# Altium project Planck-HUB.PrjPcb
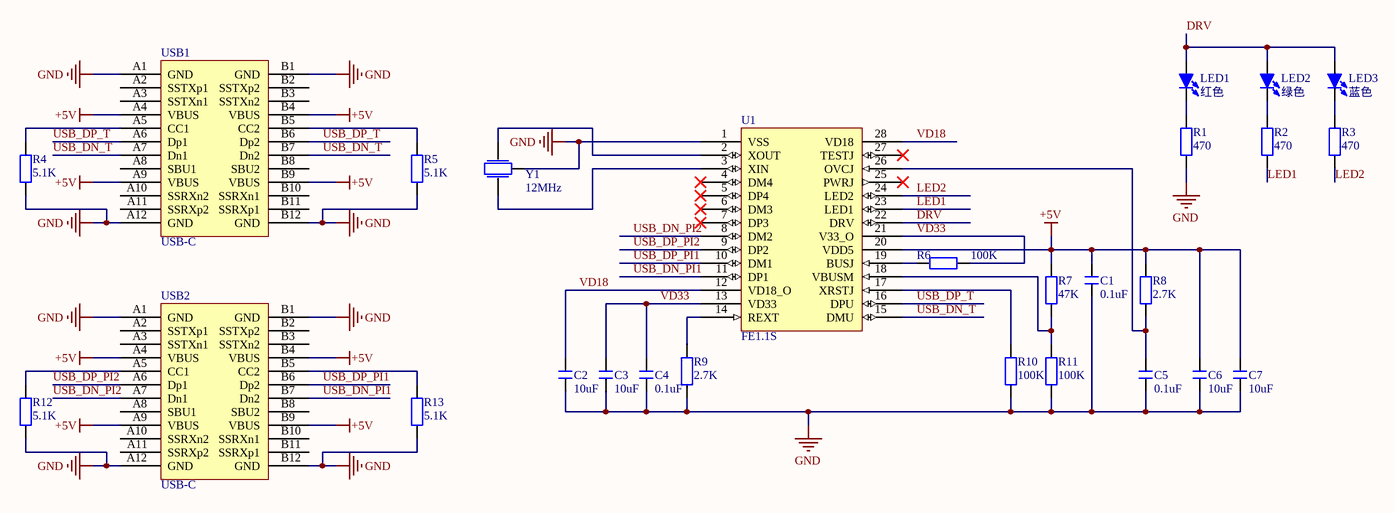
[diagram p0: Planck-HUB.SchDoc]
1 sheet, 27 parts. Net scope: global (net labels, ports and power ports of the same name join across sheets).
Board file: Planck-HUB.PcbDoc

## Sheet Planck-HUB.SchDoc
size A4; SheetNumber: 1; SheetTotal: 1

### Parts
C1  0.1uF  [C 0402_L]
C2  10uF  [C 0402_L]
C3  10uF  [C 0402_L]
C4  0.1uF  [C 0402_L]
C5  0.1uF  [C 0402_L]
C6  10uF  [C 0402_L]
C7  10uF  [C 0402_L]
LED1  红色  [LED_0402_RED]
LED2  绿色  [LED_0402_RED]
LED3  蓝色  [LED_0402_RED]
R1  470  [R 0402_L]
R2  470  [R 0402_L]
R3  470  [R 0402_L]
R4  5.1K  [R 0402_L]
R5  5.1K  [R 0402_L]
R6  100K  [R 0402_L]
R7  47K  [R 0402_L]
R8  2.7K  [R 0402_L]
R9  2.7K  [R 0402_L]
R10  100K  [R 0402_L]
R11  100K  [R 0402_L]
R12  5.1K  [R 0402_L]
R13  5.1K  [R 0402_L]
U1  FE1.1S  [SSOP28_L]
USB1  USB-C  [USB Type-C-16Pin_A]
USB2  USB-C  [USB-C-SMD_TYPE-C-31-G-01]
Y1  12MHz  [晶振-3P]

### Nets
+5V: C1.2 C6.2 C7.2 R7.1 R8.1 U1.20(VDD5) USB1.A4(VBUS) USB1.A9(VBUS) USB1.B4(VBUS) USB1.B9(VBUS) USB2.A4(VBUS) USB2.A9(VBUS) USB2.B4(VBUS) USB2.B9(VBUS)
GND: C1.1 C2.2 C3.1 C4.1 C5.1 C6.1 C7.1 R1.1 R4.1 R5.1 R9.1 R10.2 R11.2 R12.1 R13.1 U1.1(VSS) USB1.A1(GND) USB1.A12(GND) USB1.B1(GND) USB1.B12(GND) USB2.A1(GND) USB2.A12(GND) USB2.B1(GND) USB2.B12(GND) Y1.2
DRV: LED1.1(A) LED2.1(A) LED3.1(A) U1.22(DRV)
LED1: R2.1 U1.23(LED1)
LED2: R3.1 U1.24(LED2)
USB_DN_PI1: U1.11(DP1) USB2.B7(Dn2)
USB_DN_PI2: U1.8(DM2) USB2.A7(Dn1)
USB_DN_T: U1.15(DMU) USB1.A7(Dn1) USB1.B7(Dn2)
USB_DP_PI1: U1.10(DM1) USB2.B6(Dp2)
USB_DP_PI2: U1.9(DP2) USB2.A6(Dp1)
USB_DP_T: U1.16(DPU) USB1.A6(Dp1) USB1.B6(Dp2)
VD18: C2.1 U1.12(VD18_O) U1.28(VD18)
VD33: C3.2 C4.2 R6.2 U1.13(VD33) U1.21(V33_O)
NetC5_2: C5.2 R8.2 U1.26(OVCJ)
NetLED1_2: LED1.2(K) R1.2
NetLED2_2: LED2.2(K) R2.2
NetLED3_2: LED3.2(K) R3.2
NetR4_2: R4.2 USB1.A5(CC1)
NetR5_2: R5.2 USB1.B5(CC2)
NetR6_1: R6.1 U1.19(BUSJ)
NetR7_2: R7.2 R11.1 U1.18(VBUSM)
NetR9_2: R9.2 U1.14(REXT)
NetR10_1: R10.1 U1.17(XRSTJ)
NetR12_2: R12.2 USB2.A5(CC1)
NetR13_2: R13.2 USB2.B5(CC2)
NetU1_2: U1.2(XOUT) Y1.3
NetU1_3: U1.3(XIN) Y1.1

Not connected (* = marked no-connect by the designer): U1 4(DM4)* 5(DP4)* 6(DM3)* 7(DP3)* 25(PWRJ)* 27(TESTJ)*; USB1 A2(SSTXp1) A3(SSTXn1) A8(SBU1) A10(SSRXn2) A11(SSRXp2) B2(SSTXp2) B3(SSTXn2) B8(SBU2) B10(SSRXn1) B11(SSRXp1); USB2 A2(SSTXp1) A3(SSTXn1) A8(SBU1) A10(SSRXn2) A11(SSRXp2) B2(SSTXp2) B3(SSTXn2) B8(SBU2) B10(SSRXn1) B11(SSRXp1)

### Library data of the parts
C1-C7 = C: 贴片电容; BOM名称: 无极性贴片电容; 淘宝ID: 封装库来自淘宝 ID：黄晶宝石; 联系售后，技术支持: https://shop463601444.taobao.com; 唯一出售店铺网址: https://shop463601444.taobao.com
LED1-LED3 = LED-SMD: 贴片LED; 版权归属: 封装库来自淘宝 ID：黄晶宝石; BOM名称: 贴片LED; 学习资源: https://shop463601444.taobao.com
R1-R13 = R: 贴片电阻; 版权归属: 来自淘宝 ID：黄晶宝石; 封装库来自淘宝卖家 ID：黄晶宝石: 其他店铺购入均为盗版，不享受售后技术支持服务，请立即申请退款; BOM名称: 贴片电阻; 联系售后: https://shop463601444.taobao.com
U1 = FE1.1S USB HUB
USB1 USB2 = USB-C/S: USB-C型母接口; 版权归属: 源创客; BOM名称: USB-C型母接口; 学习资源: www.ooocke.com
Y1 = 晶振-3Pin: 村田贴片